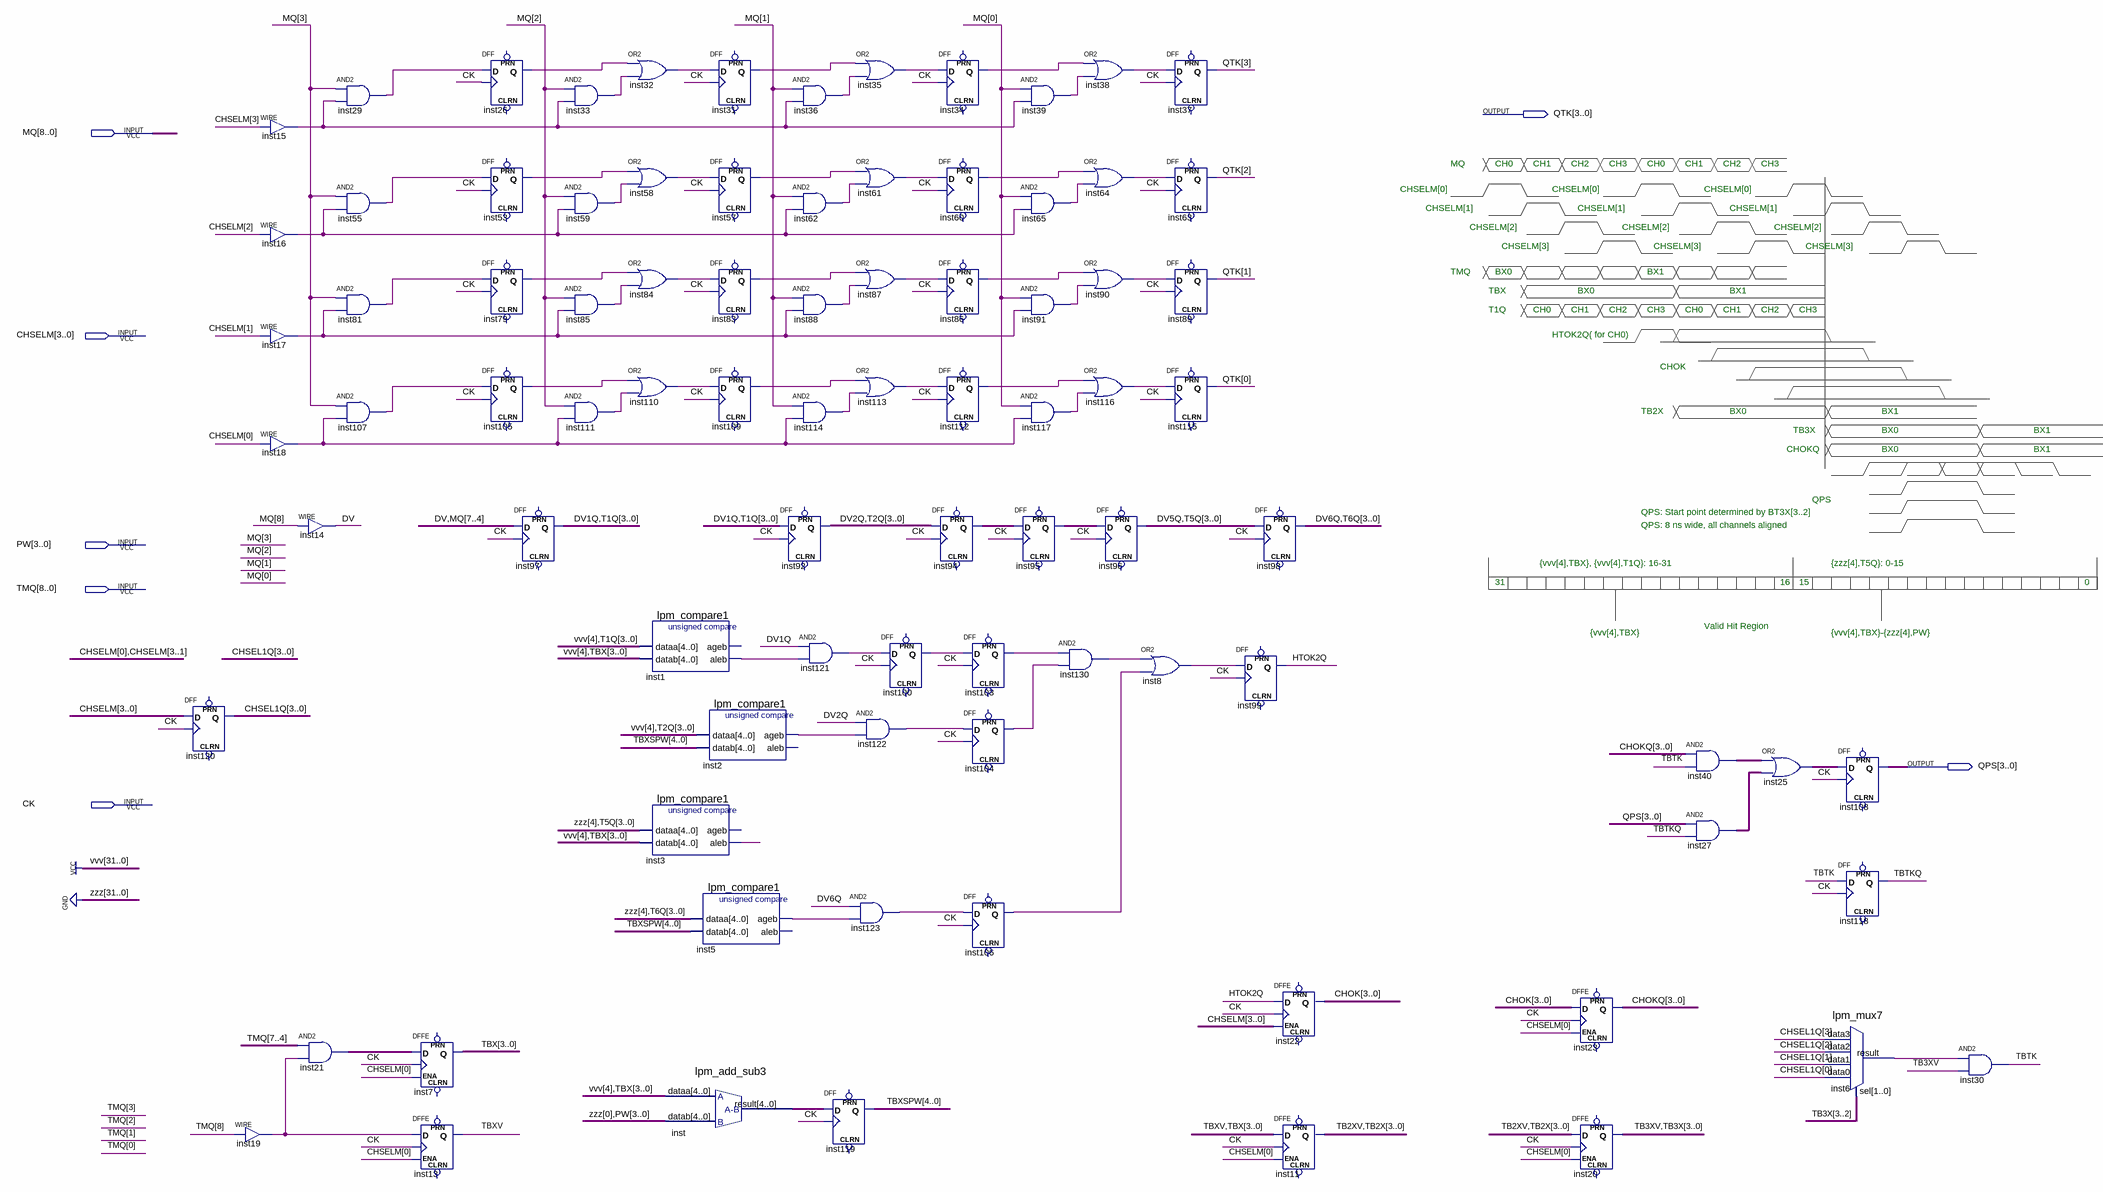
[diagram p0: schematic sheet]
// Quartus schematic ChTK32nsOut.bdf as structural Verilog: 87 symbols, 7 pins
module ChTK32nsOut (
  input  [8:0] MQ,
  input  [3:0] CHSELM,
  input  [3:0] PW,
  input  [8:0] TMQ,
  input  CK,
  output [3:0] QTK,
  output [3:0] QPS
);

  wire DV, DV1Q, DV2Q, DV5Q, DV6Q, HTOK2Q, inst1_aleb, inst2_ageb, inst3_aleb, inst5_ageb, inst6_result,
       inst8_out, inst15_out, inst16_out, inst17_out, inst18_out, inst19_out, inst26_q, inst29_out, inst31_q,
       inst32_out, inst33_out, inst34_q, inst35_out, inst36_out, inst38_out, inst39_out, inst53_q,
       inst55_out, inst57_q, inst58_out, inst59_out, inst60_q, inst61_out, inst62_out, inst64_out,
       inst65_out, inst79_q, inst81_out, inst83_q, inst84_out, inst85_out, inst86_q, inst87_out, inst88_out,
       inst90_out, inst91_out, inst100_q, inst103_q, inst104_q, inst105_q, inst106_q, inst107_out, inst109_q,
       inst110_out, inst111_out, inst112_q, inst113_out, inst114_out, inst116_out, inst117_out, inst121_out,
       inst122_out, inst123_out, inst130_out, TB2XV, TB3XV, TBTK, TBTKQ, TBXV;
  wire [3:0] CHOK, CHOKQ, CHSEL1Q, inst21_out, inst25_out, inst27_out, inst40_out, T1Q, T2Q, T5Q, T6Q, TB2X,
       TB3X, TBX;
  wire [4:0] inst94_q, inst95_q, inst_result, TBXSPW;

  DFF inst120[3:0] (.CLK(CK), .D(CHSELM), .Q(CHSEL1Q));  // open: CLRN, PRN
  assign inst19_out = TMQ[8];  // WIRE inst19
  assign inst15_out = CHSELM[3];  // WIRE inst15
  assign inst16_out = CHSELM[2];  // WIRE inst16
  assign inst17_out = CHSELM[1];  // WIRE inst17
  assign inst18_out = CHSELM[0];  // WIRE inst18
  and inst29 (inst29_out, MQ[3], inst15_out);
  and inst55 (inst55_out, MQ[3], inst16_out);
  and inst81 (inst81_out, MQ[3], inst17_out);
  and inst107 (inst107_out, MQ[3], inst18_out);
  assign DV = MQ[8];  // WIRE inst14
  assign inst21_out = TMQ[7:4] & {4{inst19_out}};  // AND2 inst21, 4 bits wide
  DFFE inst7[3:0] (.D(inst21_out), .CLK(CK), .ENA(CHSELM[0]), .Q(TBX));  // open: PRN, CLRN
  DFFE inst13 (.D(inst19_out), .CLK(CK), .ENA(CHSELM[0]), .Q(TBXV));  // open: PRN, CLRN
  DFF inst26 (.CLK(CK), .D(inst29_out), .Q(inst26_q));  // open: CLRN, PRN
  DFF inst53 (.CLK(CK), .D(inst55_out), .Q(inst53_q));  // open: CLRN, PRN
  DFF inst79 (.CLK(CK), .D(inst81_out), .Q(inst79_q));  // open: CLRN, PRN
  DFF inst105 (.CLK(CK), .D(inst107_out), .Q(inst105_q));  // open: CLRN, PRN
  DFF inst97[4:0] (.CLK(CK), .D({DV, MQ[7:4]}), .Q({DV1Q, T1Q}));  // open: CLRN, PRN
  and inst33 (inst33_out, MQ[2], inst15_out);
  and inst59 (inst59_out, MQ[2], inst16_out);
  and inst85 (inst85_out, MQ[2], inst17_out);
  and inst111 (inst111_out, MQ[2], inst18_out);
  or inst32 (inst32_out, inst26_q, inst33_out);
  or inst58 (inst58_out, inst53_q, inst59_out);
  or inst84 (inst84_out, inst79_q, inst85_out);
  or inst110 (inst110_out, inst105_q, inst111_out);
  lpm_compare1 inst1 (.dataa({1'b1, T1Q}), .datab({1'b1, TBX}), .aleb(inst1_aleb));  // open: ageb
  lpm_compare1 inst3 (.dataa({1'b0, T5Q}), .datab({1'b1, TBX}), .aleb(inst3_aleb));  // open: ageb
  lpm_compare1 inst2 (.dataa({1'b1, T2Q}), .datab(TBXSPW), .ageb(inst2_ageb));  // open: aleb
  lpm_compare1 inst5 (.dataa({1'b0, T6Q}), .datab(TBXSPW), .ageb(inst5_ageb));  // open: aleb
  lpm_add_sub3 inst (.dataa({1'b1, TBX}), .datab({1'b0, PW}), .result(inst_result));
  DFF inst31 (.CLK(CK), .D(inst32_out), .Q(inst31_q));  // open: CLRN, PRN
  DFF inst57 (.CLK(CK), .D(inst58_out), .Q(inst57_q));  // open: CLRN, PRN
  DFF inst83 (.CLK(CK), .D(inst84_out), .Q(inst83_q));  // open: CLRN, PRN
  DFF inst109 (.CLK(CK), .D(inst110_out), .Q(inst109_q));  // open: CLRN, PRN
  and inst36 (inst36_out, MQ[1], inst15_out);
  and inst62 (inst62_out, MQ[1], inst16_out);
  and inst88 (inst88_out, MQ[1], inst17_out);
  and inst114 (inst114_out, MQ[1], inst18_out);
  DFF inst92[4:0] (.CLK(CK), .D({DV1Q, T1Q}), .Q({DV2Q, T2Q}));  // open: CLRN, PRN
  and inst121 (inst121_out, DV1Q, inst1_aleb);
  and inst123 (inst123_out, DV6Q, inst5_ageb);
  DFF inst119[4:0] (.CLK(CK), .D(inst_result), .Q(TBXSPW));  // open: CLRN, PRN
  or inst35 (inst35_out, inst31_q, inst36_out);
  or inst61 (inst61_out, inst57_q, inst62_out);
  or inst87 (inst87_out, inst83_q, inst88_out);
  or inst113 (inst113_out, inst109_q, inst114_out);
  DFF inst100 (.CLK(CK), .D(inst121_out), .Q(inst100_q));  // open: CLRN, PRN
  and inst122 (inst122_out, DV2Q, inst2_ageb);
  DFF inst34 (.CLK(CK), .D(inst35_out), .Q(inst34_q));  // open: CLRN, PRN
  DFF inst60 (.CLK(CK), .D(inst61_out), .Q(inst60_q));  // open: CLRN, PRN
  DFF inst86 (.CLK(CK), .D(inst87_out), .Q(inst86_q));  // open: CLRN, PRN
  DFF inst112 (.CLK(CK), .D(inst113_out), .Q(inst112_q));  // open: CLRN, PRN
  DFF inst94[4:0] (.CLK(CK), .D({DV2Q, T2Q}), .Q(inst94_q));  // open: CLRN, PRN
  DFF inst103 (.CLK(CK), .D(inst100_q), .Q(inst103_q));  // open: CLRN, PRN
  DFF inst104 (.CLK(CK), .D(inst122_out), .Q(inst104_q));  // open: CLRN, PRN
  DFF inst106 (.CLK(CK), .D(inst123_out), .Q(inst106_q));  // open: CLRN, PRN
  and inst39 (inst39_out, MQ[0], inst15_out);
  and inst65 (inst65_out, MQ[0], inst16_out);
  and inst91 (inst91_out, MQ[0], inst17_out);
  and inst117 (inst117_out, MQ[0], inst18_out);
  DFF inst95[4:0] (.CLK(CK), .D(inst94_q), .Q(inst95_q));  // open: CLRN, PRN
  or inst38 (inst38_out, inst34_q, inst39_out);
  or inst64 (inst64_out, inst60_q, inst65_out);
  or inst90 (inst90_out, inst86_q, inst91_out);
  or inst116 (inst116_out, inst112_q, inst117_out);
  DFF inst96[4:0] (.CLK(CK), .D(inst95_q), .Q({DV5Q, T5Q}));  // open: CLRN, PRN
  and inst130 (inst130_out, inst103_q, inst104_q);
  or inst8 (inst8_out, inst130_out, inst106_q);
  DFF inst37 (.CLK(CK), .D(inst38_out), .Q(QTK[3]));  // open: CLRN, PRN
  DFF inst63 (.CLK(CK), .D(inst64_out), .Q(QTK[2]));  // open: CLRN, PRN
  DFF inst89 (.CLK(CK), .D(inst90_out), .Q(QTK[1]));  // open: CLRN, PRN
  DFF inst115 (.CLK(CK), .D(inst116_out), .Q(QTK[0]));  // open: CLRN, PRN
  DFF inst98[4:0] (.CLK(CK), .D({DV5Q, T5Q}), .Q({DV6Q, T6Q}));  // open: CLRN, PRN
  DFF inst99 (.CLK(CK), .D(inst8_out), .Q(HTOK2Q));  // open: CLRN, PRN
  DFFE inst22[3:0] (.D(HTOK2Q), .CLK(CK), .ENA(CHSELM), .Q(CHOK));  // open: PRN, CLRN
  DFFE inst11[4:0] (.D({TBXV, TBX}), .CLK(CK), .ENA(CHSELM[0]), .Q({TB2XV, TB2X}));  // open: PRN, CLRN
  DFFE inst23[3:0] (.D(CHOK), .CLK(CK), .ENA(CHSELM[0]), .Q(CHOKQ));  // open: PRN, CLRN
  DFFE inst20[4:0] (.D({TB2XV, TB2X}), .CLK(CK), .ENA(CHSELM[0]), .Q({TB3XV, TB3X}));  // open: PRN, CLRN
  assign inst40_out = CHOKQ & {4{TBTK}};  // AND2 inst40, 4 bits wide
  assign inst27_out = QPS & {4{TBTKQ}};  // AND2 inst27, 4 bits wide
  assign inst25_out = inst40_out | inst27_out;  // OR2 inst25, 4 bits wide
  DFF inst108[3:0] (.CLK(CK), .D(inst25_out), .Q(QPS));  // open: CLRN, PRN
  DFF inst118 (.CLK(CK), .D(TBTK), .Q(TBTKQ));  // open: CLRN, PRN
  lpm_mux7 inst6 (
    .data3(CHSEL1Q[3]), .data2(CHSEL1Q[2]), .data1(CHSEL1Q[1]), .data0(CHSEL1Q[0]), .sel(TB3X[3:2]),
    .result(inst6_result));
  and inst30 (TBTK, inst6_result, TB3XV);

  // Notes on the sheet:
  //   MQ
  //   CH0
  //   CH1
  //   CH2
  //   CH3
  //   CH0
  //   CH1
  //   CH2
  //   CH3
  //   CHSELM[0]
  //   CHSELM[0]
  //   CHSELM[0]
  //   CHSELM[1]
  //   CHSELM[1]
  //   CHSELM[1]
  //   CHSELM[2]
  //   CHSELM[2]
  //   CHSELM[2]
  //   CHSELM[3]
  //   CHSELM[3]
  //   CHSELM[3]
  //   TMQ
  //   BX0
  //   BX1
  //   TBX
  //   BX0
  //   BX1
  //   T1Q
  //   CH0
  //   CH1
  //   CH2
  //   CH3
  //   CH0
  //   CH1
  //   CH2
  //   CH3
  //   HTOK2Q( for CH0)
  //   CHOK
  //   TB2X
  //   BX0
  //   BX1
  //   TB3X
  //   BX0
  //   BX1
  //   CHOKQ
  //   BX0
  //   BX1
  //   QPS
  //   QPS: Start point determined by BT3X[3..2]
  //   QPS: 8 ns wide, all channels aligned
  //   {vvv[4],TBX}, {vvv[4],T1Q}: 16-31
  //   {zzz[4],T5Q}: 0-15
  //   31
  //   16
  //   15
  //   0
  //   Valid Hit Region
  //   {vvv[4],TBX}
  //   {vvv[4],TBX}-{zzz[4],PW}
endmodule
